# EasyEDA Pro project mate_ROV_power2.eprj

# Schematic Schematic1
Create Date: 2024-01-18; Page Name: P1; Project Name: mate_ROV_power; Schematic Name: Schematic1; Update Date: 2024-01-19; Company: 嘉立创EDA; Page Size: A4; Version: V1.0
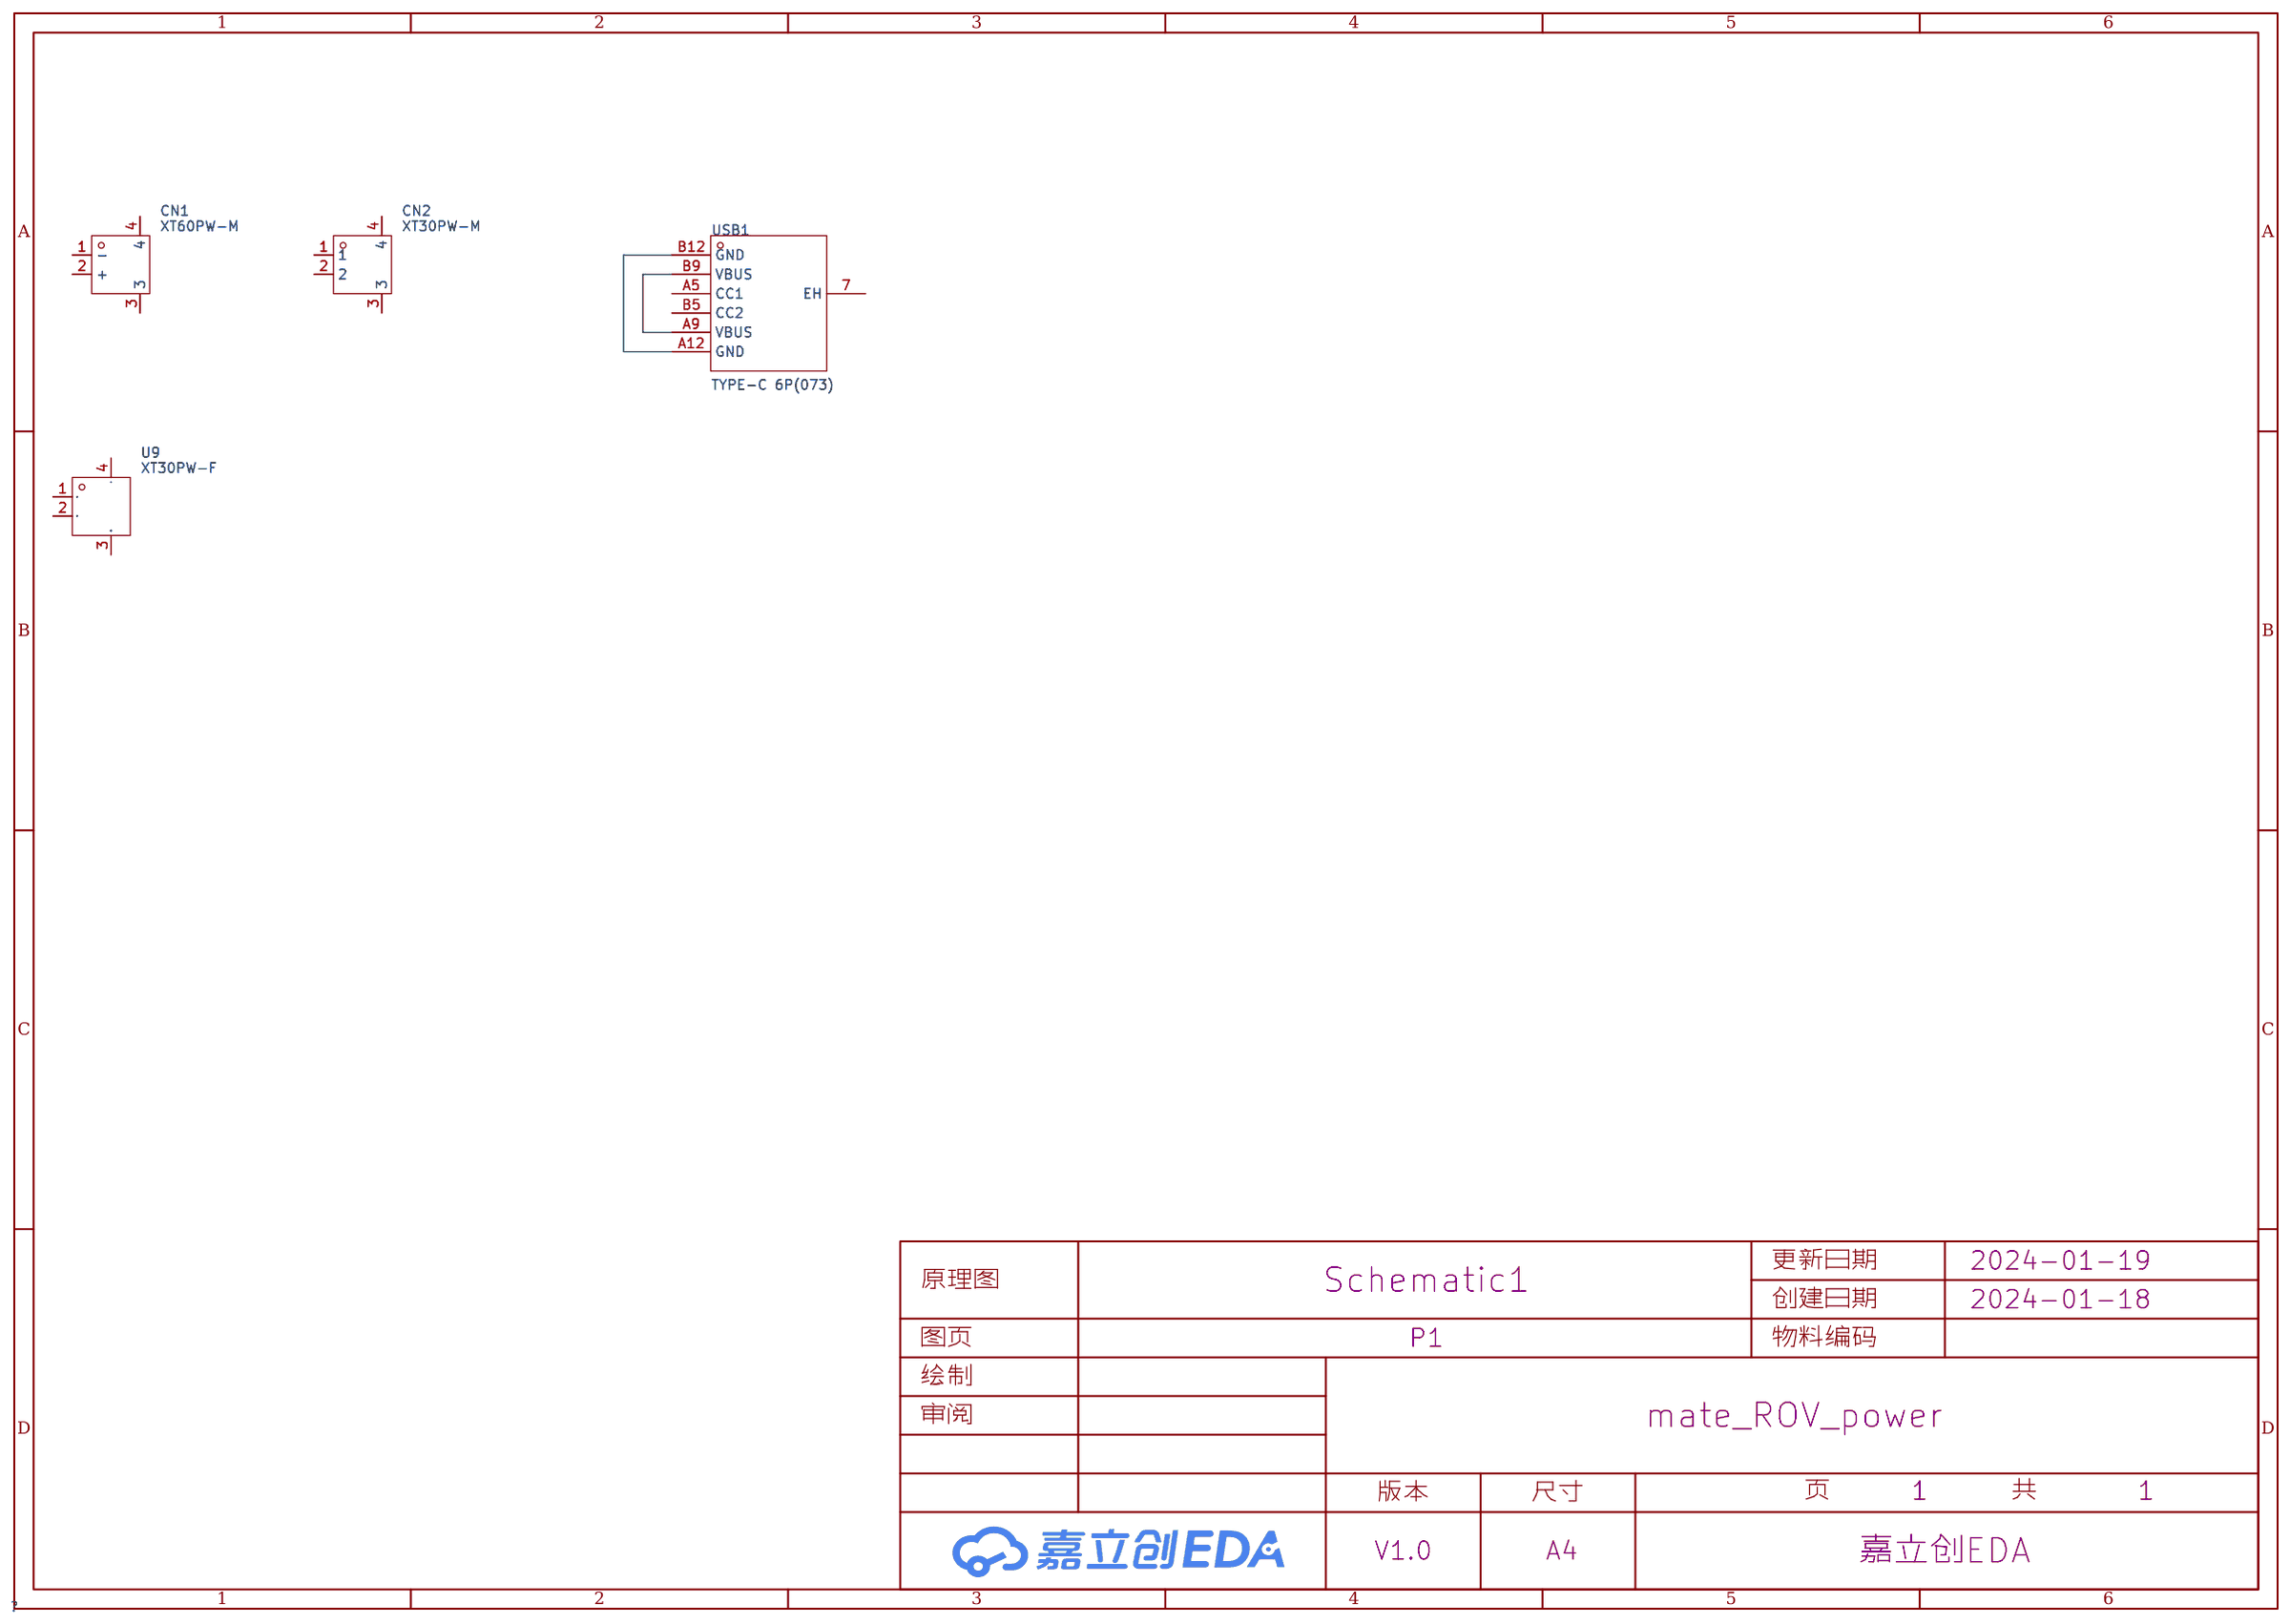
[diagram p0: schematic sheet]

## Parts
CN1  XT60PW-M  [CONN-TH_XT60PW-M]
CN2  XT30PW-M  [CONN-TH_XT30PW-M]
U9  XT30PW-F  [CONN-TH_XT30PW-F-1]
USB1  TYPE-C 6P(073)  [TYPE-C-SMD_TYPE-C-6P]

## Library data of the parts
CN1 = XT60PW-M: 类别:-;类型1:-;; LCSC Part Name: AMASS(艾迈斯)航模插头xt60连接器150公母对接pw锂电池公头 板插卧式XT60PW-M; Supplier Part: C98732; Manufacturer: AMASS(艾迈斯); JLCPCB Part Class: Extended Part; Datasheet: https://atta.szlcsc.com/upload/public/pdf/source/20190916/C428722_DFF78979486FCB0B58C1FC563067EC88.pdf; Supplier: LCSC; Brand: 艾迈斯; Type: 卧式插头; Colour: 黄色; InterfaceType: 公头
CN2 = XT30PW-M: 类别:-;类型1:-;; LCSC Part Name: AMASS(艾迈斯)航模插头 卧式弯脚 XT30PW-M公头; Supplier Part: C431092; Manufacturer: AMASS(艾迈斯); JLCPCB Part Class: Extended Part; Datasheet: https://atta.szlcsc.com/upload/public/pdf/source/20220222/6A9F22F7850E25B33E1BE430ADF8560B.pdf; Supplier: LCSC; Brand: 艾迈斯; Type: 航模插头; RatedVoltage: DC 500V; InterfaceType: 公头; RatedCurrent: 15A; RecommendedWireGauge: 16/18/20AWG; contact resistance: 1.2mΩ; specifications: 2pin
U9 = XT30PW-F: 类别:-;类型1:-;; LCSC Part Name: AMASS(艾迈斯)电源连接器 母头 XT30PW-F; Supplier Part: C2913282; Manufacturer: AMASS(艾迈斯); JLCPCB Part Class: Extended Part; Datasheet: https://atta.szlcsc.com/upload/public/pdf/source/20190916/C428722_DFF78979486FCB0B58C1FC563067EC88.pdf; Supplier: LCSC; Brand: 艾迈斯; Type: 航模插头; InterfaceType: 母头
USB1 = TYPE-C 6P(073): 连接器类型:Type-C;标准:-;公母:母;端口数量:1;触点数量:6P;安装方式:卧贴;额定电流 - 电源:5A;工作温度范围:-25℃~+85℃;; LCSC Part Name: Type-C 母 卧贴; Supplier Part: C668623; Manufacturer: SHOU HAN(首韩); Supplier Footprint: SMD; JLCPCB Part Class: 扩展库; Datasheet: https://atta.szlcsc.com/upload/public/pdf/source/20200618/C668623_A4B260DED7AC1949BAC6AE39E9F4CD80.pdf; Supplier: LCSC; Connector Type: Type-C; Gender: 母; Number of Ports: 1; Number of Contacts: 6P; Mounting Style: 卧贴; Current Rating - Power (Max): 5A; Operating Temperature Range: -25℃~+85℃

## Nets
5V: USB1.A9(VBUS) USB1.B9(VBUS)
Net-(USB1-A12): USB1.A12(GND) USB1.B12(GND)

Not connected (* = marked no-connect by the designer): CN1 1(-) 2(+) 3 4; CN2 1 2 3 4; U9 1 2 3 4; USB1 7(EH) A5(CC1) B5(CC2)

# Board PCB1
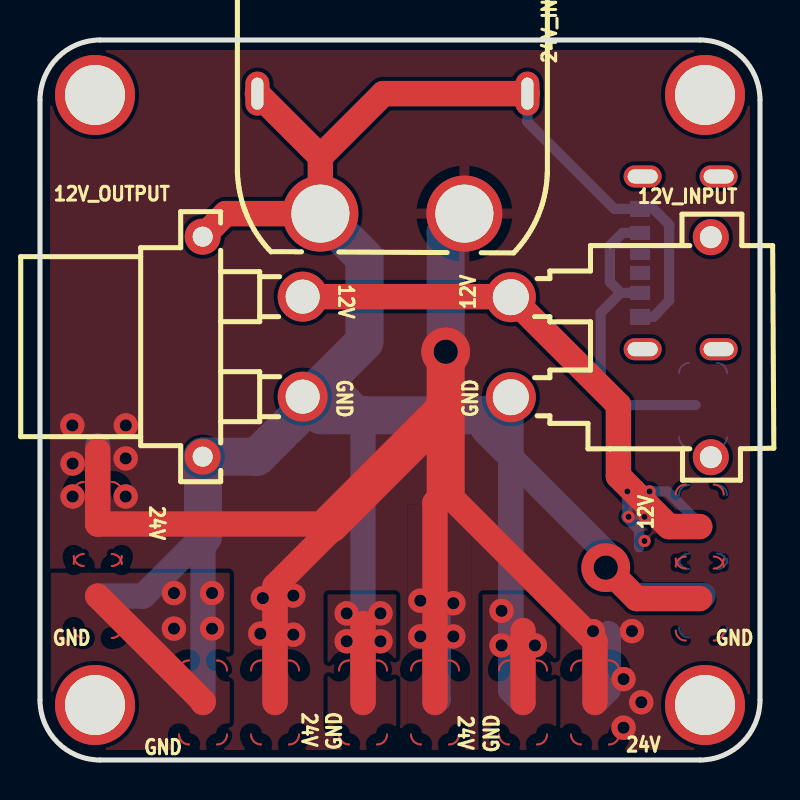
[diagram p1: board, top side]
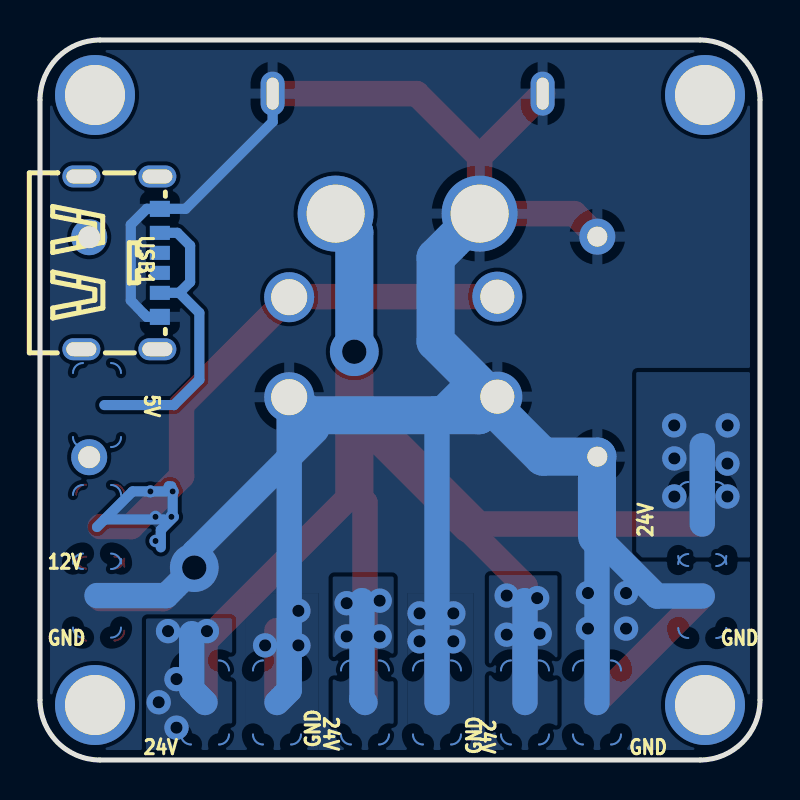
[diagram p2: board, bottom side, seen from below]

Outline 36 x 36 mm; copper layers: Top Layer, Bottom Layer. Coordinates in mm from the lower left corner of the outline.
Outline path: 0,33 0,3 arc(0.88,0.88) 3,0 33,0 arc(35.12,0.88) 36,3 36,33 arc(35.12,35.12) 33,36 3,36 arc(0.88,35.12) 0,33
Stack: Top Layer 0.035mm / Dielectric1 1.51mm FR4 er 4.5 / Bottom Layer 0.035mm

## Design rules (mm)
template: JLCPCB Capability(Two Layers Board)
spacing copperThickness1oz (default): track to track 0.102, other pairs 0.152 to 0.3
spacing copperThickness2oz: track to track 0.203, other pairs 0.152 to 0.3
track width copperThickness1oz (default): min 0.127, default 0.254, max 2.54
track width copperThickness2oz: min 0.203, default 0.254, max 2.54
differential pair differentialPair (default): width min 0.127, default 0.254, max 2.54; gap min 0.152, default 0.152
via viaSize (default): diameter min 0.5, default 0.61, max 10; hole min 0.3, default 0.305, max 6.3

## Placement (name value [footprint] x y rotation side)
12V_INPUT  XT30PW-M  [CONN-TH_XT30PW-M]  28.54 20.64 90 top
12V_OUTPUT  XT30PW-F  [CONN-TH_XT30PW-F-1]  10.63 20.67 270 top
24V_INPUT  XT60PW-M  [CONN-TH_XT60PW-M]  17.62 30.32 270 top
NOREF  -  [Pad_e61]  32.99 11.67 90 top
NOREF#2  -  [Pad_e59]  2.89 11.8 90 top
NOREF#3  -  [Pad_e3]  11.75 2.88 0 top
NOREF#4  -  [Pad_e22]  33.25 33.25 0 top
NOREF#5  -  [Pad_e114]  33.15 17.75 90 top
NOREF#6  -  [Pad_e57]  8.15 2.88 0 top
NOREF#7  -  [Pad_e115]  33.15 8.22 90 top
NOREF#8  -  [Pad_e54]  16.15 2.88 0 top
NOREF#9  -  [Pad_e2]  8.15 2.88 0 top
NOREF#10  -  [Pad_e58]  2.89 8.2 90 top
NOREF#11  -  [Pad_e24]  33.25 2.75 0 top
NOREF#12  -  [Pad_e47]  2.89 11.8 90 top
NOREF#13  -  [Pad_e60]  32.99 8.07 90 top
NOREF#14  -  [Pad_e23]  2.75 2.75 0 top
NOREF#15  -  [Pad_e116]  33.15 11.65 90 top
NOREF#16  -  [Pad_e48]  27.75 2.88 0 top
NOREF#17  -  [Pad_e56]  11.75 2.88 0 top
NOREF#18  -  [Pad_e42]  19.75 2.88 0 top
NOREF#19  -  [Pad_e44]  27.75 2.88 0 top
NOREF#20  -  [Pad_e51]  24.15 2.88 0 top
NOREF#21  -  [Pad_e45]  24.15 2.88 0 top
NOREF#22  -  [Pad_e46]  2.89 8.2 90 top
NOREF#23  -  [Pad_e11]  2.75 33.25 0 top
NOREF#24  -  [Pad_e43]  16.15 2.88 0 top
NOREF#25  -  [Pad_e53]  19.75 2.88 0 top
USB1  TYPE-C 6P(073)  [TYPE-C-SMD_TYPE-C-6P]  31.97 24.86 270 bottom

## Footprints (pads in the part's own frame, mm; a bottom-side part is the same pattern mirrored in y, then rotated)
CONN-TH_XT30PW-F-1
  round 2.5 hole 1.7: 1(-2.5,2.5) 2(2.5,2.5)
  round 1.8 hole 1: 3(5.5,-2.5) 4(-5.5,-2.5)
CONN-TH_XT30PW-M
  round 2.5 hole 1.8: 1(-2.5,5) 2(2.5,5)
  round 1.8 hole 1.1: 3(5.5,-5) 4(-5.5,-5)
CONN-TH_XT60PW-M
  round 3.8 hole 2.9: 1(3,-3.6) 2(3,3.6)
  oval 2.2x1.2 hole 1.6x0.6: 3(-3,6.75) 4(-3,-6.75)
Pad_e2
  custom 0x0 smd: 9(0,0)
Pad_e3
  custom 0x0 smd: 10(0,0)
Pad_e11
  round 4 hole 3: 5(0,0)
Pad_e22
  round 4 hole 3: 6(0,0)
Pad_e23
  round 4 hole 3: 7(0,0)
Pad_e24
  round 4 hole 3: 8(0,0)
Pad_e42
  custom 0x0 smd: 11(0,0)
Pad_e43
  custom 0x0 smd: 10(0,0)
Pad_e44
  custom 0x0 smd: 12(0,0)
Pad_e45
  custom 0x0 smd: 11(0,0)
Pad_e46
  custom 0x0 smd: 9(0,0)
Pad_e47
  custom 0x0 smd: 10(0,0)
Pad_e48
  custom 0x0 smd far side: 12(0,0)
Pad_e51
  custom 0x0 smd far side: 11(0,0)
Pad_e53
  custom 0x0 smd far side: 11(0,0)
Pad_e54
  custom 0x0 smd far side: 10(0,0)
Pad_e56
  custom 0x0 smd far side: 10(0,0)
Pad_e57
  custom 0x0 smd far side: 9(0,0)
Pad_e58
  custom 0x0 smd far side: 9(0,0)
Pad_e59
  custom 0x0 smd far side: 10(0,0)
Pad_e60
  custom 4.2x2.4 smd: 9(0,0)
Pad_e61
  custom 4.2x2.4 smd: 10(0,0)
Pad_e114
  custom 4.2x2.4 smd far side: 10(0,0)
Pad_e115
  custom 4.2x2.4 smd far side: 9(0,0)
Pad_e116
  custom 4.2x2.4 smd far side: 10(0,0)
TYPE-C-SMD_TYPE-C-6P
  oval 1.1x1.9 hole 0.7x1.5: 7(-4.32,-1.962) 7(-4.32,1.837) 7(4.32,-1.962) 7(4.32,1.837)
  rect 0.7x1 smd: A5(-0.5,1.962) A9(1.5,1.962) B5(0.5,1.962) B9(-1.5,1.962)
  rect 0.8x1 smd: A12(2.7,1.962) B12(-2.7,1.962)

## Nets
5V: NOREF#5.10 USB1.A9 USB1.B9
12V: 12V_INPUT.2 12V_OUTPUT.1 NOREF.10 NOREF#15.10
24V: 24V_INPUT.2 NOREF#2.10 NOREF#3.10 NOREF#12.10 NOREF#16.12 NOREF#17.10 NOREF#18.11 NOREF#19.12 NOREF#25.11
GND: 12V_INPUT.1 12V_OUTPUT.2 12V_OUTPUT.3 12V_OUTPUT.4 24V_INPUT.1 24V_INPUT.3 24V_INPUT.4 NOREF#6.9 NOREF#7.9 NOREF#8.10 NOREF#9.9 NOREF#10.9 NOREF#13.9 NOREF#20.11 NOREF#21.11 NOREF#22.9 NOREF#24.10 USB1.A12 USB1.B12

Pads without a net: 12V_INPUT 3 4; NOREF#4 6; NOREF#11 8; NOREF#14 7; NOREF#23 5; USB1 7 A5 B5

## Via types
v1: diameter 1.219, hole 0.61, Top Layer to Bottom Layer, 30 vias
v2: diameter 2.438, hole 1.219, Top Layer to Bottom Layer, 2 vias
v3: diameter 0.61, hole 0.305, Top Layer to Bottom Layer, 5 vias

## Routing (per net, layer and track width the routed paths; a pad name or vN(x,y) marks a point on that pad's centre or on a via; arc(x,y) is an arc through that point)
12V: length 27
  Top Layer w1.27: 12V_INPUT.2 28.92,17.76 28.92,14.19 31.44,11.67 NOREF.10
  Bottom Layer w0.508: 29.3,12.16 29.96,11.5 29.96,10.63 ; 29.43,13.68 29.56,13.68 29.37,13.49 v3(29.37,13.43) 29.37,12.22 v3(29.43,12.16) ; 32.77,12.03 31.37,13.43 v3(30.48,13.43) 29.68,13.43 ; 32.77,12.03 29.81,12.03 ; 32.77,12.03 NOREF#15.10
  vias: v3(30.22,12.16) v3(30.22,10.95)
24V: length 90.1
  Top Layer w1.27: 2.89,15.46 NOREF#2.10 14.5,11.8 14.5,11.46 11.75,8.7 NOREF#3.10 ; NOREF#16.12 27.75,5.93 20.29,13.4 19.75,12.86 NOREF#18.11
  Top Layer w1.905: v2(20.29,20.41) 20.29,17.58 ; 20.29,17.58 14.5,11.8 ; 20.29,17.58 20.29,13.4
  Bottom Layer w1.27: NOREF#2.10 2.89,15.71 ; NOREF#18.11 19.91,3.03 19.91,7.97 ; 11.78,7.97 11.75,7.94 NOREF#3.10 ; 28.41,6.32 28.41,3.54 NOREF#16.12
  Bottom Layer w1.905: 24V_INPUT.2 20.29,26.39 v2(20.29,20.41)
  vias: v1(1.62,16.73) v1(1.63,14.82) v1(1.63,13.17) v1(4.29,16.73) v1(4.28,15.08) v1(4.28,13.17) v1(11.01,6.32) v1(11.14,8.09) v1(12.67,8.22) v1(12.67,6.27) v1(19.02,7.97) v1(19.02,6.18) v1(20.67,7.84) v1(20.67,6.18) v1(27.65,6.44) v1(29.18,4.04) v1(29.18,1.62) v1(29.6,6.44) v1(30.06,2.89)
GND: length 136.7
  Top Layer w1.27: NOREF#10.9 8.15,2.94 NOREF#6.9 ; NOREF#8.10 16.15,6.82 ; 14.02,30.17 24V_INPUT.4 ; 14.02,30.17 24V_INPUT.1 9.29,27.32 12V_OUTPUT.4 ; 14.02,30.17 17.17,33.32 24V_INPUT.3 ; NOREF#13.9 29.83,8.07 v2(28.29,9.62)
  Bottom Layer w1.27: NOREF#10.9 5.16,8.2 8.15,11.19 NOREF#6.9 ; 23.54,15.13 22.19,16.48 ; 23.54,15.13 12V_INPUT.1 ; 23.54,15.13 28.29,10.38 v2(28.29,9.62) 29.68,8.22 NOREF#7.9 ; 23.54,15.13 23.54,3.49 NOREF#20.11 ; 14.95,18.51 16.15,17.31 NOREF#8.10
  Bottom Layer w1.905: 24V_INPUT.1 16.22,25.12 16.22,20.92 13.47,18.17 12V_OUTPUT.2 ; 12V_OUTPUT.2 13.13,17.45 10.85,15.17 12V_OUTPUT.3 8.15,15.15 8.15,11.19 ; 12V_OUTPUT.2 14.06,17.24 22.64,17.24 12V_INPUT.1
  vias: v1(6.7,8.35) v1(6.7,6.57) v1(8.6,8.35) v1(8.6,6.57) v1(15.33,7.33) v1(15.33,5.94) v1(17.02,7.33) v1(17.02,5.94) v1(23.08,7.46) v1(23.08,5.73) v1(24.74,5.73)
5V: length 15.4
  Bottom Layer w0.508: 29.03,23.36 28.49,23.9 28.49,25.72 29.13,26.36 USB1.B9 ; 29.03,23.36 28.03,22.36 28.03,19.02 29.3,17.75 32.78,17.75 ; 29.03,23.36 USB1.A9

## Copper pours and planes (outline as drawn; the poured copper is in the pictures)
12V on Top Layer: 28.29,14.44 35.65,14.44 35.65,10.13 28.29,10.13
12V on Bottom Layer: 28.29,14.44 35.65,14.44 35.65,10.13 28.29,10.13
24V on Top Layer: 18.38,12.79 21.56,12.79 21.56,0.22 18.38,0.22
24V on Top Layer: -15.02,40.61 42.13,40.61 42.13,-5.62 -15.02,-5.62
24V on Bottom Layer: 26.39,7.08 30.7,7.08 30.7,0.22 26.39,0.22
24V on Bottom Layer: 10.13,9.24 13.56,9.24 13.56,0.22 10.13,0.22
24V on Bottom Layer: 18.32,9.17 21.37,9.17 21.37,0.16 18.32,0.16
24V on Bottom Layer: 0.47,19.4 6.19,19.4 6.19,10.13 0.47,10.13
GND on Top Layer: 0.54,9.36 9.49,9.36 9.49,0.16 0.54,0.16
GND on Top Layer: 22.13,8.28 25.81,8.28 25.81,0.16 22.13,0.16
GND on Top Layer: 14.38,8.28 17.81,8.28 17.81,0.16 14.38,0.16
GND on Bottom Layer: 14.32,8.35 17.62,8.35 17.62,0.22 14.32,0.22
GND on Bottom Layer: -2.07,36.03 37.69,36.03 37.69,-1.18 -2.07,-1.18
GND on Bottom Layer: 22.06,8.35 25.75,8.35 25.75,0.22 22.06,0.22

## Text on the board
Bottom Solder Mask Layer: dingzhen_smoker
Bottom Silkscreen Layer: 24V | GND | 5V | 12V
Top Solder Mask Layer: 锐刻五代
Top Silkscreen Layer: GND | 12V | 24V
